# Altium schematic sheet Power.SchDoc: Наименование
size 209 x 297 mm; ApprovedBy: Утвердил; CheckedBy: Проверил; Author: Разработал; CompanyName: Организация; DrawnBy: Н.Контр; Engineer: Т.Контр; SheetNumber: 2; SheetTotal: 6; PageSetup: Record=PageOptions|CenterHorizontal=True|CenterVertical=True|PrintScale=0.94|XCorrection=1.00|YCorrection=1.00|PrintKind=1|BorderSize=5000000|LeftOffset=0|BottomOffset=0|Orientation=1|PaperLength=1000|PaperWidth=1000|Scale=100|PaperSource=7|PrintQuality=-4|MediaType=1|DitherType=10|PaperKind=A4|PrintScaleMode=1; DecimalNumber: Децимальный номер; HeadOfSector: Нач. сектора; MainDevice: Перв.примен.; Name: Наименование; DocumentName: Sheet1.SCHDOC
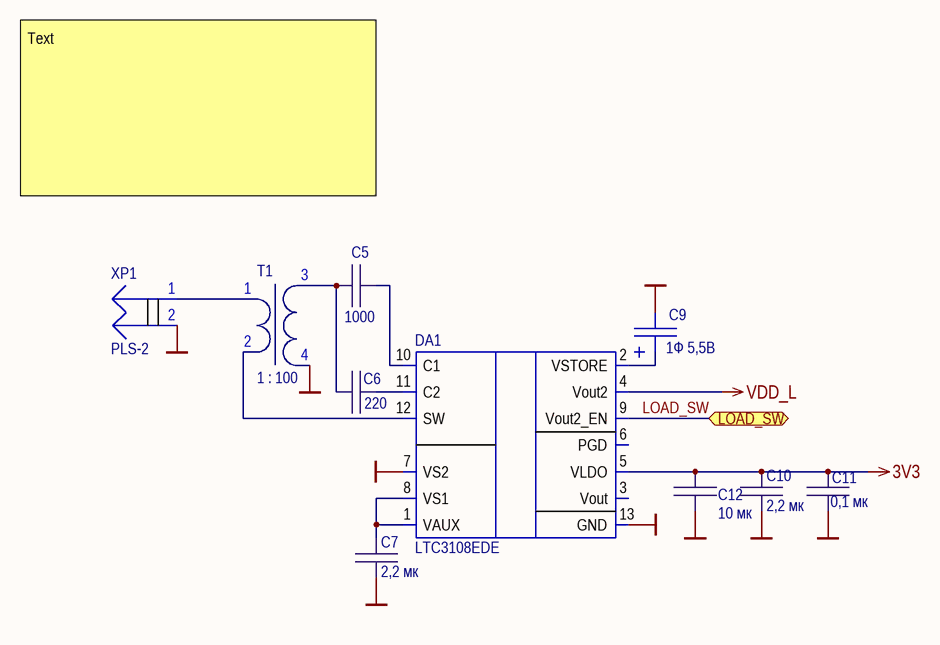
[diagram p0: Power.SchDoc]

## Parts
C5  1000  [C_0603]
C6  220  [C_0603]
C7  2,2 мк  [C_0603]
C9  1Ф 5,5В  [EECF5R5u]
C10  2,2 мк  [C_0603]
C11  0,1 мк  [C_0603]
C12  10 мк  [C_0603]
DA1  LTC3108EDE  [DFN-12]
T1  1 : 100  [LPR6235]
XP1  PLS-2  [PLS-2]

## Ports
LOAD_SW (bidir)

## Nets
3V3: C10.2 C11.2 C12.2 DA1.5(VLDO)
GND: C7.1 C9.2 C10.1 C11.1 C12.1 DA1.7(VS2) DA1.13(GND) T1.4 XP1.2
VDD_L: DA1.4(Vout2)
LOAD_SW: DA1.9(Vout2_EN) ; port LOAD_SW
NetC5_1: C5.1 C6.1 T1.3
NetC5_2: C5.2 DA1.10(C1)
NetC6_2: C6.2 DA1.11(C2)
NetC7_2: C7.2 DA1.1(VAUX) DA1.8(VS1)
NetC9_1: C9.1 DA1.2(VSTORE)
NetDA1_12: DA1.12(SW) T1.2
NetT1_1: T1.1 XP1.1

Not connected (* = marked no-connect by the designer): DA1 3(Vout) 6(PGD)

## Notes on the sheet
- Text
- Подп. и дата
- Инв.№ дубл.
- Взам.инв.№
- Подп.и дата
- Инв.№ подл.
- Изм.
- Лист
- № докум.
- Подп.
- Дата
- Формат  A4

## Library data of the parts
C5 = GRM1885C1H102FA01J: CAP CER 1000PF 50V C0G/NP0 0603; Manufacturer: Murata Electronics; Part Number: GRM1885C1H102FA01J; Value: 1000pF; ComponentLink1URL: https://www.murata.com/~/media/webrenewal/support/library/catalog/products/capacitor/mlcc/c02e.ashx?la=en-us; ComponentLink1Description: Datasheet; Component Type: Capasitor
C6 = GRM1885C2A221FA01D: CAP CER 220PF 100V C0G/NP0 0603; Manufacturer: Murata Electronics; Part Number: GRM1885C2A221FA01D; Value: 220pF; ComponentLink1URL: https://www.murata.com/~/media/webrenewal/support/library/catalog/products/capacitor/mlcc/c02e.ashx?la=en-us; ComponentLink1Description: Datasheet; Component Type: Capasitor
C7 C10 = GRM188R61E225MA12D: CAP CER 2.2UF 25V X5R 0603; Manufacturer: Murata Electronics; Value: 2.2µF; Part Number: GRM188R61E225MA12D; ComponentLink1URL: https://search.murata.co.jp/Ceramy/image/img/A01X/G101/ENG/GRM188R61E225MA12-01.pdf; ComponentLink1Description: Datasheet; Component Type: Capasitor
C9 = EECF5R5U105: 1 Ф, 5.5 В, 5 мм, 2208H, Ионистор
C11 = GRM188R72A104MA35D: CAP CER 0.1UF 100V X7R 0603; Manufacturer: Murata Electronics; Value: 0.1µF; Part Number: GRM188R72A104MA35D; ComponentLink1URL: https://search.murata.co.jp/Ceramy/image/img/A01X/G101/ENG/GRM188R72A104MA35-01.pdf; ComponentLink1Description: Datasheet; Component Type: Capasitor
C12 = GRM185R60J106ME15J: CAP CER 10UF 6.3V X5R 0603; Manufacturer: Murata Electronics; Value: 10µF; Part Number: GRM185R60J106ME15J; ComponentLink1URL: https://search.murata.co.jp/Ceramy/image/img/A01X/G101/ENG/GRM185R60J106ME15-01.pdf; ComponentLink1Description: Datasheet; Component Type: Capasitor
DA1 = LTC3108EDE: Ultralow Voltage Step-Up Converter and Power Manager
T1 = LPR6235-752SMR: Coupled Inductor